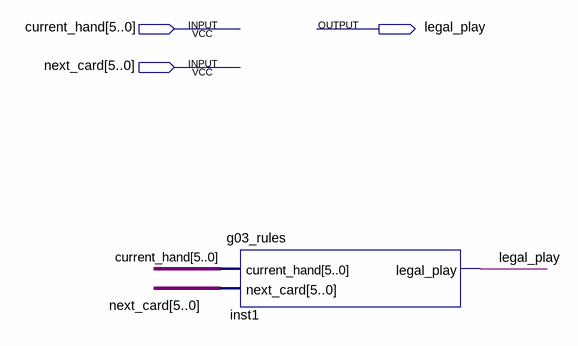
[diagram p0: schematic sheet]
// Quartus schematic g03_lab4_rules.bdf as structural Verilog: 1 symbols, 3 pins
module g03_lab4_rules (
  input  [5:0] current_hand,
  input  [5:0] next_card,
  output legal_play
);

  g03_rules inst1 (.current_hand(current_hand), .next_card(next_card), .legal_play(legal_play));
endmodule
